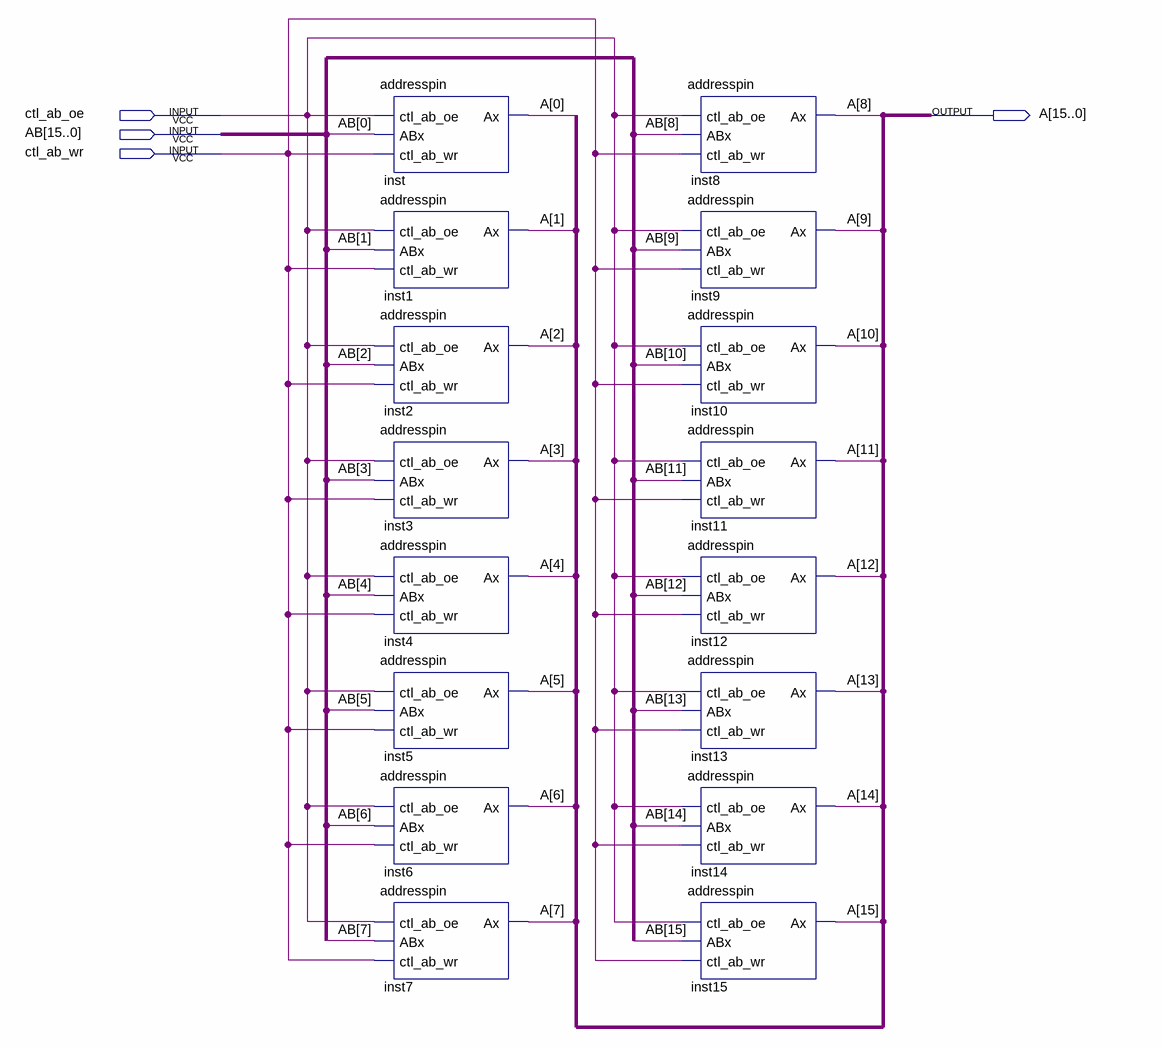
[diagram p0: schematic sheet]
// Quartus schematic addressbus.bdf as structural Verilog: 16 symbols, 4 pins
module addressbus (
  input  ctl_ab_oe,
  input  [15:0] AB,
  input  ctl_ab_wr,
  output [15:0] A
);

  addresspin inst (.ctl_ab_oe(ctl_ab_oe), .ABx(AB[0]), .ctl_ab_wr(ctl_ab_wr), .Ax(A[0]));
  addresspin inst1 (.ctl_ab_oe(ctl_ab_oe), .ABx(AB[1]), .ctl_ab_wr(ctl_ab_wr), .Ax(A[1]));
  addresspin inst2 (.ctl_ab_oe(ctl_ab_oe), .ABx(AB[2]), .ctl_ab_wr(ctl_ab_wr), .Ax(A[2]));
  addresspin inst3 (.ctl_ab_oe(ctl_ab_oe), .ABx(AB[3]), .ctl_ab_wr(ctl_ab_wr), .Ax(A[3]));
  addresspin inst4 (.ctl_ab_oe(ctl_ab_oe), .ABx(AB[4]), .ctl_ab_wr(ctl_ab_wr), .Ax(A[4]));
  addresspin inst5 (.ctl_ab_oe(ctl_ab_oe), .ABx(AB[5]), .ctl_ab_wr(ctl_ab_wr), .Ax(A[5]));
  addresspin inst6 (.ctl_ab_oe(ctl_ab_oe), .ABx(AB[6]), .ctl_ab_wr(ctl_ab_wr), .Ax(A[6]));
  addresspin inst7 (.ctl_ab_oe(ctl_ab_oe), .ABx(AB[7]), .ctl_ab_wr(ctl_ab_wr), .Ax(A[7]));
  addresspin inst8 (.ctl_ab_oe(ctl_ab_oe), .ABx(AB[8]), .ctl_ab_wr(ctl_ab_wr), .Ax(A[8]));
  addresspin inst9 (.ctl_ab_oe(ctl_ab_oe), .ABx(AB[9]), .ctl_ab_wr(ctl_ab_wr), .Ax(A[9]));
  addresspin inst10 (.ctl_ab_oe(ctl_ab_oe), .ABx(AB[10]), .ctl_ab_wr(ctl_ab_wr), .Ax(A[10]));
  addresspin inst11 (.ctl_ab_oe(ctl_ab_oe), .ABx(AB[11]), .ctl_ab_wr(ctl_ab_wr), .Ax(A[11]));
  addresspin inst12 (.ctl_ab_oe(ctl_ab_oe), .ABx(AB[12]), .ctl_ab_wr(ctl_ab_wr), .Ax(A[12]));
  addresspin inst13 (.ctl_ab_oe(ctl_ab_oe), .ABx(AB[13]), .ctl_ab_wr(ctl_ab_wr), .Ax(A[13]));
  addresspin inst14 (.ctl_ab_oe(ctl_ab_oe), .ABx(AB[14]), .ctl_ab_wr(ctl_ab_wr), .Ax(A[14]));
  addresspin inst15 (.ctl_ab_oe(ctl_ab_oe), .ABx(AB[15]), .ctl_ab_wr(ctl_ab_wr), .Ax(A[15]));
endmodule
